# EAGLE design Netzteil-Treiber (EAGLE 6.2)
Treiberstufe für Linearen Spannungs- und Stomregler mit OP
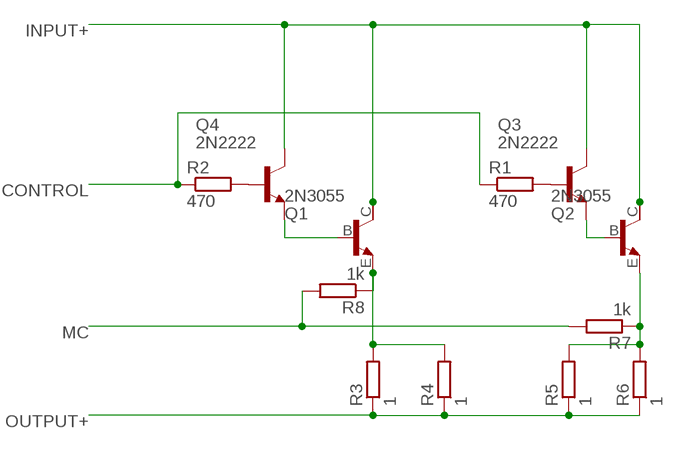
[diagram p0: schematic, sheet 1]

## Parts
Q1  2N3055  [TO3]
Q2  2N3055  [TO3]
Q3  2N2222  [TO18]
Q4  2N2222  [TO18]
R1  470  R-EU_0207/12  [0207/12]
R2  470  R-EU_0207/12  [0207/12]
R3  1  R-EU_0207/12  [0207/12]
R4  1  R-EU_0207/12  [0207/12]
R5  1  R-EU_0207/12  [0207/12]
R6  1  R-EU_0207/12  [0207/12]
R7  1k  R-EU_0207/12  [0207/12]
R8  1k  R-EU_0207/12  [0207/12]

## Nets
CONTROL: R1.1 R2.1
INPUT+: Q1.C Q2.C Q3.3(C) Q4.3(C)
MC: R7.2 R8.2
N$1: Q3.2(B) R1.2
N$2: Q4.2(B) R2.2
N$3: Q1.E R3.2 R4.2 R8.1
N$5: Q1.B Q4.1(E)
N$7: Q2.B Q3.1(E)
N$12: Q2.E R5.2 R6.2 R7.1
OUTPUT+: R3.1 R4.1 R5.1 R6.1
Unconnected: Q1.C/(C) Q2.C/(C)

## Library data of the parts
Q1 Q2 = transistor-npn:2N3055: NPN Transistor
Q3 Q4 = transistor-npn:2N2222*: NPN Transistor
R1-R8 = resistor:R-EU_: RESISTOR, European symbol

## Board
Treiberstufe für Netzteil
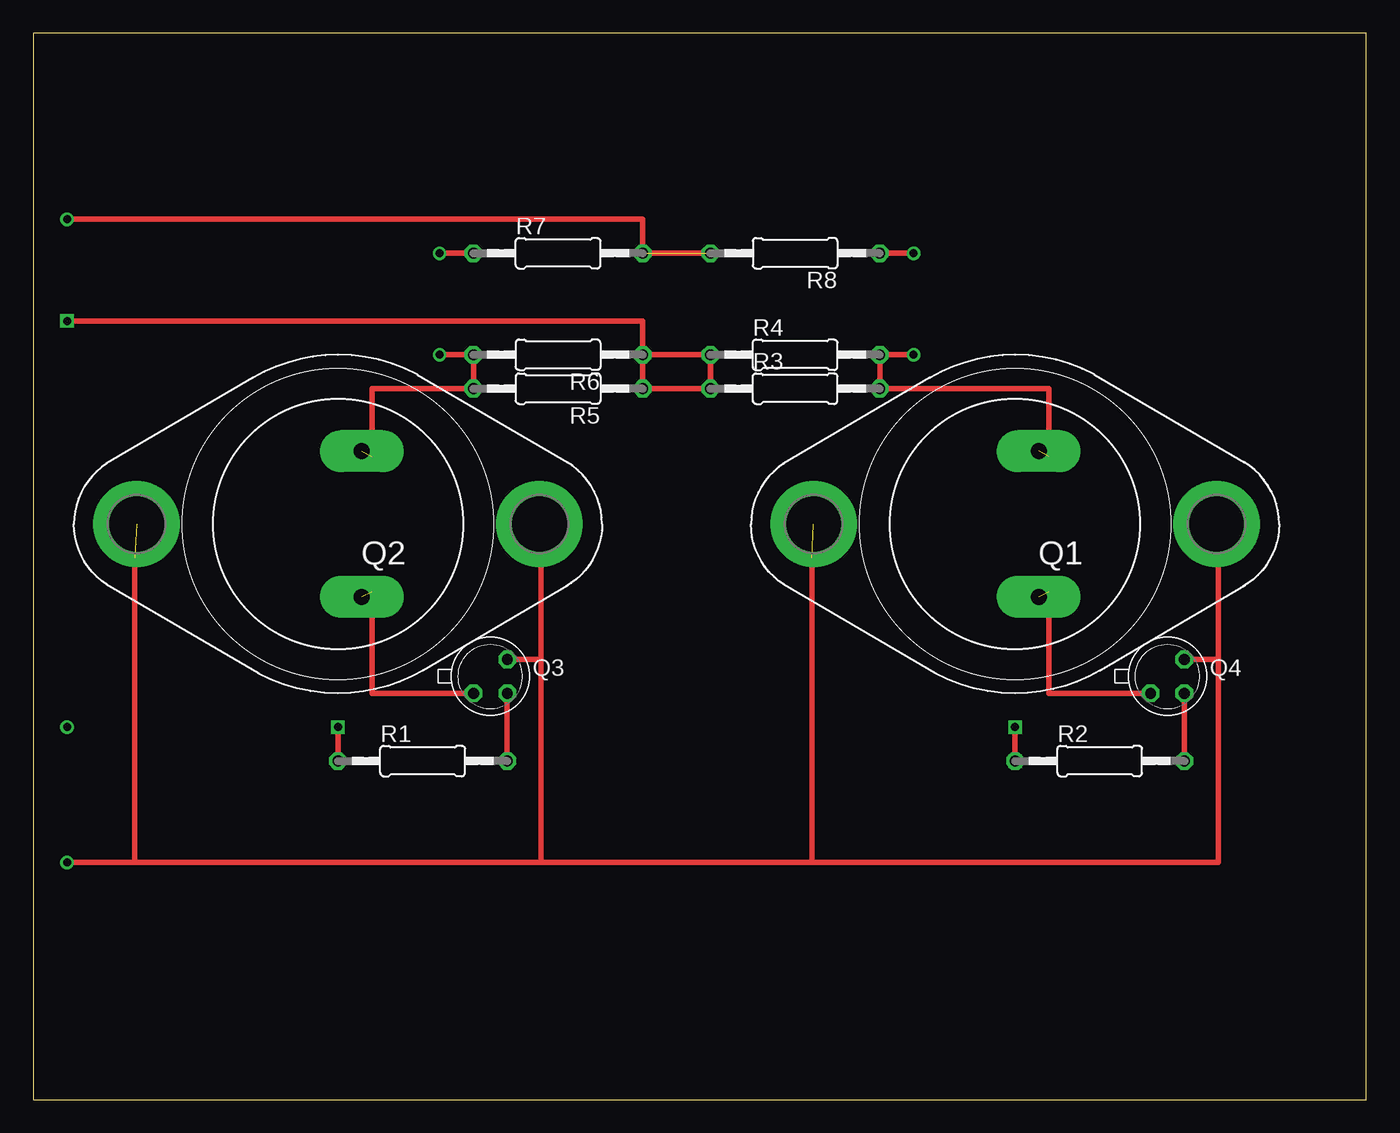
[diagram p1: board, top side]
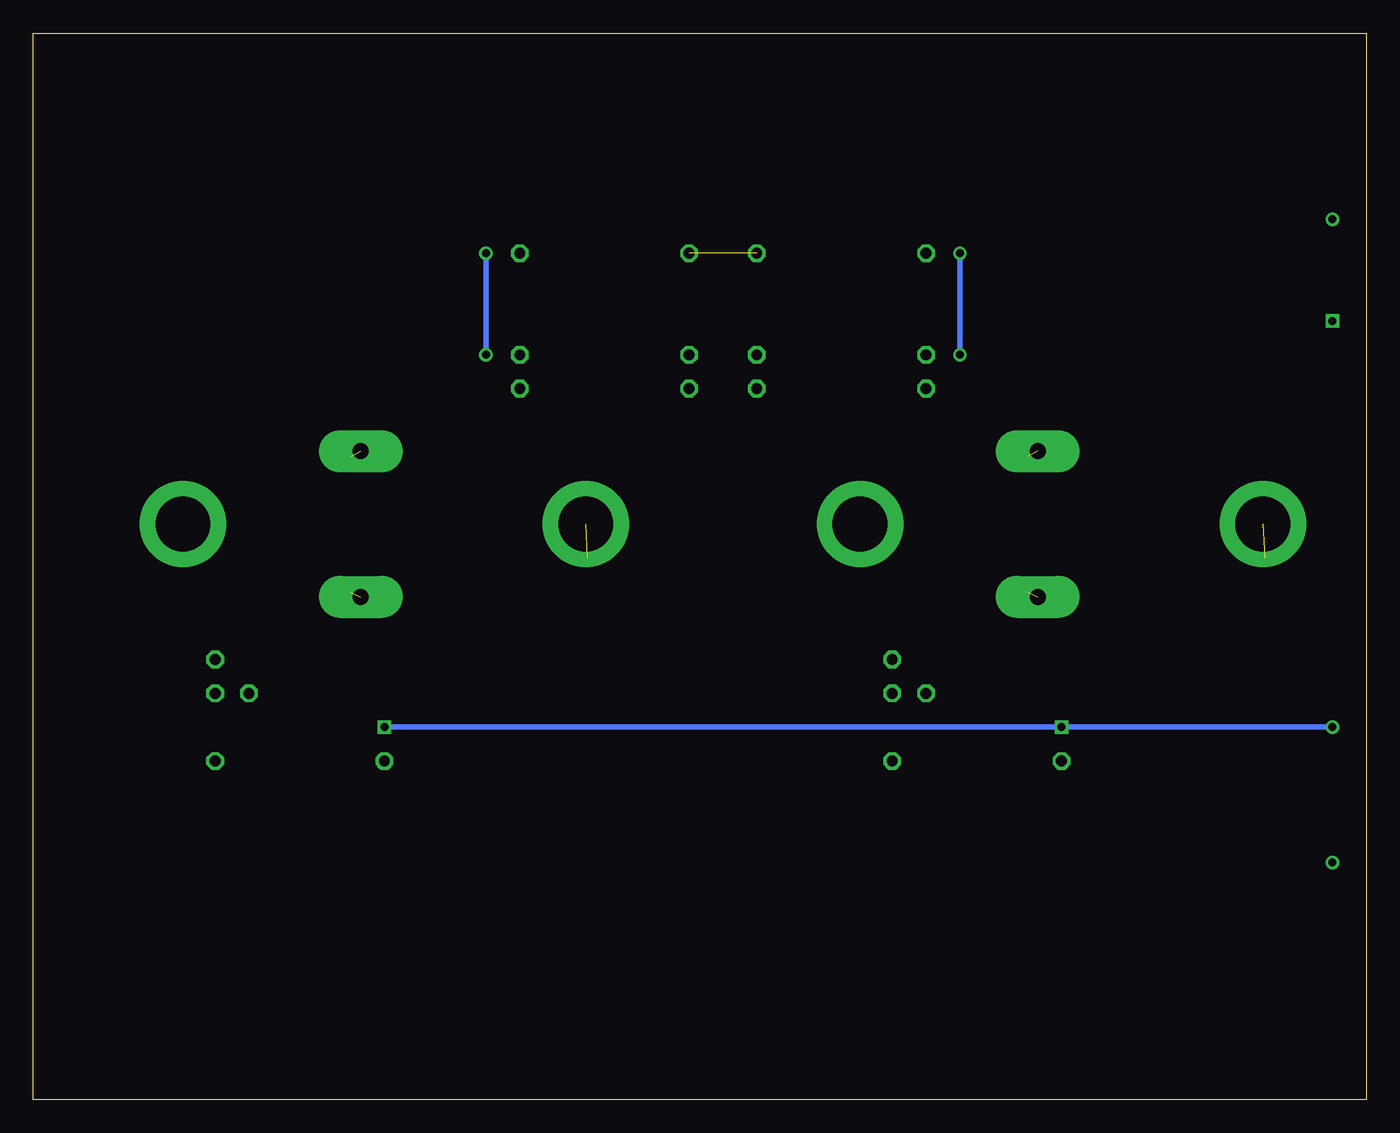
[diagram p2: board, bottom side, seen from below]

Size 100 x 80 mm. Coordinates in mm from the lower left corner, seen from the top.
Outline: 0,0 100,0 100,80 0,80 0,0
Copper layers (1*16): Top 0.035mm / dielectric 1.5mm / Bottom 0.035mm
Design rules: minimum track width 10mil, minimum drill 24mil, track to track 8mil, track to pad 8mil, pad to pad 8mil, via to via 8mil, smd to smd 8mil, copper to edge 40mil, drill to drill 8mil, minimum pad ring 10mil, minimum via ring 8mil, stop-mask expansion 4mil, vias tented up to drill 0mil, thermal gap 10mil

### Footprints (pad centres in the part's own frame; a part is rotated, then mirrored left to right if it is on the bottom)
TO3 = drill 1.194 pad 3.15 long: B -1.778,5.461; E -1.778,-5.461 | drill 4.115 pad 6.477: C 15.113,0; C/ -15.113,0
TO18 = drill 0.813 octagon: 1 -1.27,-1.27; 2 1.27,-1.27; 3 1.27,1.27
0207/12 = drill 0.813 octagon: 1 -6.35,0; 2 6.35,0

### Placement (x,y rotation side)
Q1  73.66,43.18 180 top
Q2  22.86,43.18 180 top
Q3  34.29,31.75 0 top
Q4  85.09,31.75 0 top
R1  29.21,25.4 0 top
R2  80.01,25.4 0 top
R3  57.15,53.34 0 top
R4  57.15,55.88 0 top
R5  39.37,53.34 180 top
R6  39.37,55.88 180 top
R7  39.37,63.5 0 top
R8  57.15,63.5 180 top

### Tracks (layer width: path | path; a pad name or v marks a point on that pad's centre or on a via)
CONTROL  (via drill 0.6)
  Top 0.406: R1.1 v22.86,27.94 | R2.1 v73.66,27.94
  Bottom 0.406: v73.66,27.94 v22.86,27.94 v2.54,27.94
  other vias: 73.66,25.4
INPUT+  (via drill 0.6)  (2 unrouted)
  Top 0.406: Q3.3 38.1,33.02 | 38.1,33.02 38.1,40.64 | 38.1,33.02 38.1,17.78 | 38.1,17.78 58.42,17.78 | 58.42,17.78 88.9,17.78 88.9,33.02 | 88.9,40.64 88.9,33.02 | Q4.3 88.9,33.02 | 58.42,17.78 58.42,40.64 | 38.1,17.78 7.62,17.78 | v2.54,17.78 7.62,17.78 | 7.62,17.78 7.62,40.64
MC  (via drill 0.6)  (1 unrouted)
  Top 0.406: R8.2 R7.2 45.72,66.04 v2.54,66.04
N$1
  Top 0.406: R1.2 Q3.2
N$2
  Top 0.406: R2.2 Q4.2
N$3  (via drill 0.6)  (1 unrouted)
  Top 0.406: 76.2,48.26 76.2,53.34 R3.2 R4.2 v66.04,55.88 | R8.1 v66.04,63.5
  Bottom 0.406: v66.04,55.88 v66.04,63.5
N$5  (1 unrouted)
  Top 0.406: Q4.1 76.2,30.48 76.2,38.1
N$7  (1 unrouted)
  Top 0.406: Q3.1 25.4,30.48 25.4,38.1
N$12  (via drill 0.6)  (1 unrouted)
  Top 0.406: R7.1 v30.48,63.5 | v30.48,55.88 R6.2 R5.2 25.4,53.34 25.4,48.26
  Bottom 0.406: v30.48,55.88 v30.48,63.5
OUTPUT+  (via drill 0.6)  (1 unrouted)
  Top 0.406: R6.1 R4.1 R3.1 R5.1 R6.1 | R6.1 45.72,58.42 v2.54,58.42